# Altium schematic sheet Logic in.SchDoc
size A4
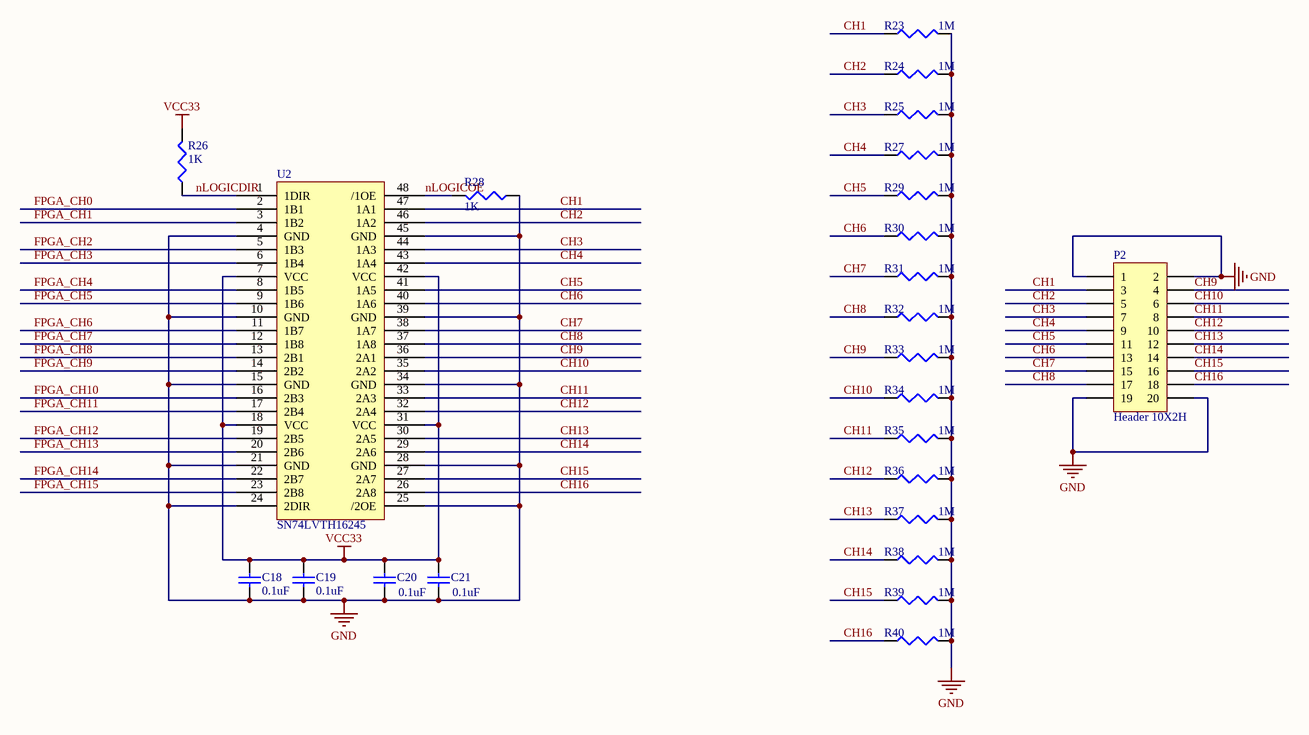
[diagram p0: Logic in.SchDoc]

## Parts
C18  value 0.1uF  [cc0603]
C19  value 0.1uF  [cc0603]
C20  value 0.1uF  [cc0603]
C21  value 0.1uF  [cc0603]
P2  Header 10X2H  [HDR2X10]
R23  value 1M  [CR0603]
R24  value 1M  [CR0603]
R25  value 1M  [CR0603]
R26  value 1K  [CR0603]
R27  value 1M  [CR0603]
R28  value 1K  [CR0603]
R29  value 1M  [CR0603]
R30  value 1M  [CR0603]
R31  value 1M  [CR0603]
R32  value 1M  [CR0603]
R33  value 1M  [CR0603]
R34  value 1M  [CR0603]
R35  value 1M  [CR0603]
R36  value 1M  [CR0603]
R37  value 1M  [CR0603]
R38  value 1M  [CR0603]
R39  value 1M  [CR0603]
R40  value 1M  [CR0603]
U2  SN74LVTH16245  [SN74HC16245]

## Nets
GND: C18.2 C19.2 C20.1 C21.1 P2.1 P2.2 P2.19 P2.20 R23.2 R24.2 R25.2 R27.2 R28.1 R29.2 R30.2 R31.2 R32.2 R33.2 R34.2 R35.2 R36.2 R37.2 R38.2 R39.2 R40.2 U2.4(GND) U2.10(GND) U2.15(GND) U2.21(GND) U2.24(2DIR) U2.25(/2OE) U2.28(GND) U2.34(GND) U2.39(GND) U2.45(GND)
VCC33: C18.1 C19.1 C20.2 C21.2 R26.2 U2.7(VCC) U2.18(VCC) U2.31(VCC) U2.42(VCC)
CH1: P2.3 R23.1 U2.47(1A1)
CH2: P2.5 R24.1 U2.46(1A2)
CH3: P2.7 R25.1 U2.44(1A3)
CH4: P2.9 R27.1 U2.43(1A4)
CH5: P2.11 R29.1 U2.41(1A5)
CH6: P2.13 R30.1 U2.40(1A6)
CH7: P2.15 R31.1 U2.38(1A7)
CH8: P2.17 R32.1 U2.37(1A8)
CH9: P2.4 R33.1 U2.36(2A1)
CH10: P2.6 R34.1 U2.35(2A2)
CH11: P2.8 R35.1 U2.33(2A3)
CH12: P2.10 R36.1 U2.32(2A4)
CH13: P2.12 R37.1 U2.30(2A5)
CH14: P2.14 R38.1 U2.29(2A6)
CH15: P2.16 R39.1 U2.27(2A7)
CH16: P2.18 R40.1 U2.26(2A8)
FPGA_CH0: U2.2(1B1)
FPGA_CH1: U2.3(1B2)
FPGA_CH2: U2.5(1B3)
FPGA_CH3: U2.6(1B4)
FPGA_CH4: U2.8(1B5)
FPGA_CH5: U2.9(1B6)
FPGA_CH6: U2.11(1B7)
FPGA_CH7: U2.12(1B8)
FPGA_CH8: U2.13(2B1)
FPGA_CH9: U2.14(2B2)
FPGA_CH10: U2.16(2B3)
FPGA_CH11: U2.17(2B4)
FPGA_CH12: U2.19(2B5)
FPGA_CH13: U2.20(2B6)
FPGA_CH14: U2.22(2B7)
FPGA_CH15: U2.23(2B8)
nLOGICDIR: R26.1 U2.1(1DIR)
nLOGICOE: R28.2 U2.48(/1OE)

## Library data of the parts
C18-C21 = Cap: Capacitor; Published: 8-Jun-2000; LatestRevisionDate: 17-Jul-2002; LatestRevisionNote: Re-released for DXP Platform.; PackageReference: RAD-0.3; Publisher: Altium Limited
P2 = Header 10X2H: Header, 10-Pin, Dual row, Right Angle; LatestRevisionDate: 17-Jul-2002; LatestRevisionNote: Re-released for DXP Platform.; Publisher: Altium Limited
R23-R40 = Res3: Resistor; Published: 8-Jun-2000; LatestRevisionDate: 04-Mar-2005; LatestRevisionNote: PCB Footprint replaced.; PackageReference: J1-0603; Publisher: Altium Limited